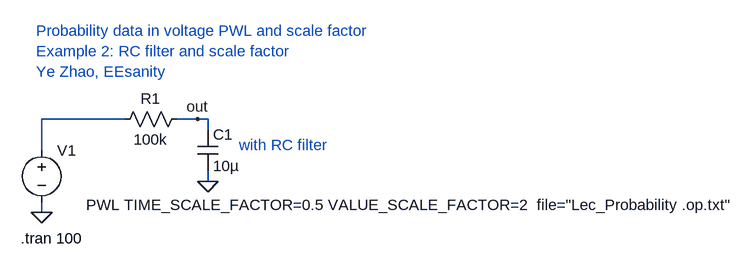
[diagram p0: schematic LTspice 07-2 Probability and PWL voltage_ex2.asc]
LTspice 07-2 Probability and PWL voltage_ex2.asc, the LTspice schematic file:
Version 4
SHEET 1 1452 680
WIRE 192 80 64 80
WIRE 304 80 272 80
WIRE 320 80 304 80
WIRE 320 96 320 80
WIRE 64 128 64 80
WIRE 320 176 320 160
WIRE 64 224 64 208
FLAG 64 224 0
FLAG 320 176 0
FLAG 304 80 out
SYMBOL voltage 64 112 R0
WINDOW 123 0 0 Left 2
WINDOW 39 0 0 Left 2
WINDOW 3 69 100 Left 2
SYMATTR Value PWL TIME_SCALE_FACTOR=0.5 VALUE_SCALE_FACTOR=2  file="Lec_Probability .op.txt"
SYMATTR InstName V1
SYMBOL res 288 64 R90
WINDOW 0 0 56 VBottom 2
WINDOW 3 32 56 VTop 2
SYMATTR InstName R1
SYMATTR Value 100k
SYMBOL cap 304 96 R0
SYMATTR InstName C1
SYMATTR Value 10µ
TEXT 32 264 Left 2 !.tran 100
TEXT 368 120 Left 2 ;with RC filter
TEXT 56 -56 Left 2 ;Probability data in voltage PWL and scale factor\nExample 2: RC filter and scale factor\nYe Zhao, EEsanity

The netlist it stands for:
* LTspice 07-2 Probability and PWL voltage_ex2.asc
V1 N001 0 PWL TIME_SCALE_FACTOR=0.5 VALUE_SCALE_FACTOR=2  file="Lec_Probability .op.txt"
R1 out N001 100k
C1 out 0 10µ
.tran 100
* with RC filter
* Probability data in voltage PWL and scale factor
* Example 2: RC filter and scale factor
* Ye Zhao, EEsanity
.backanno
.end